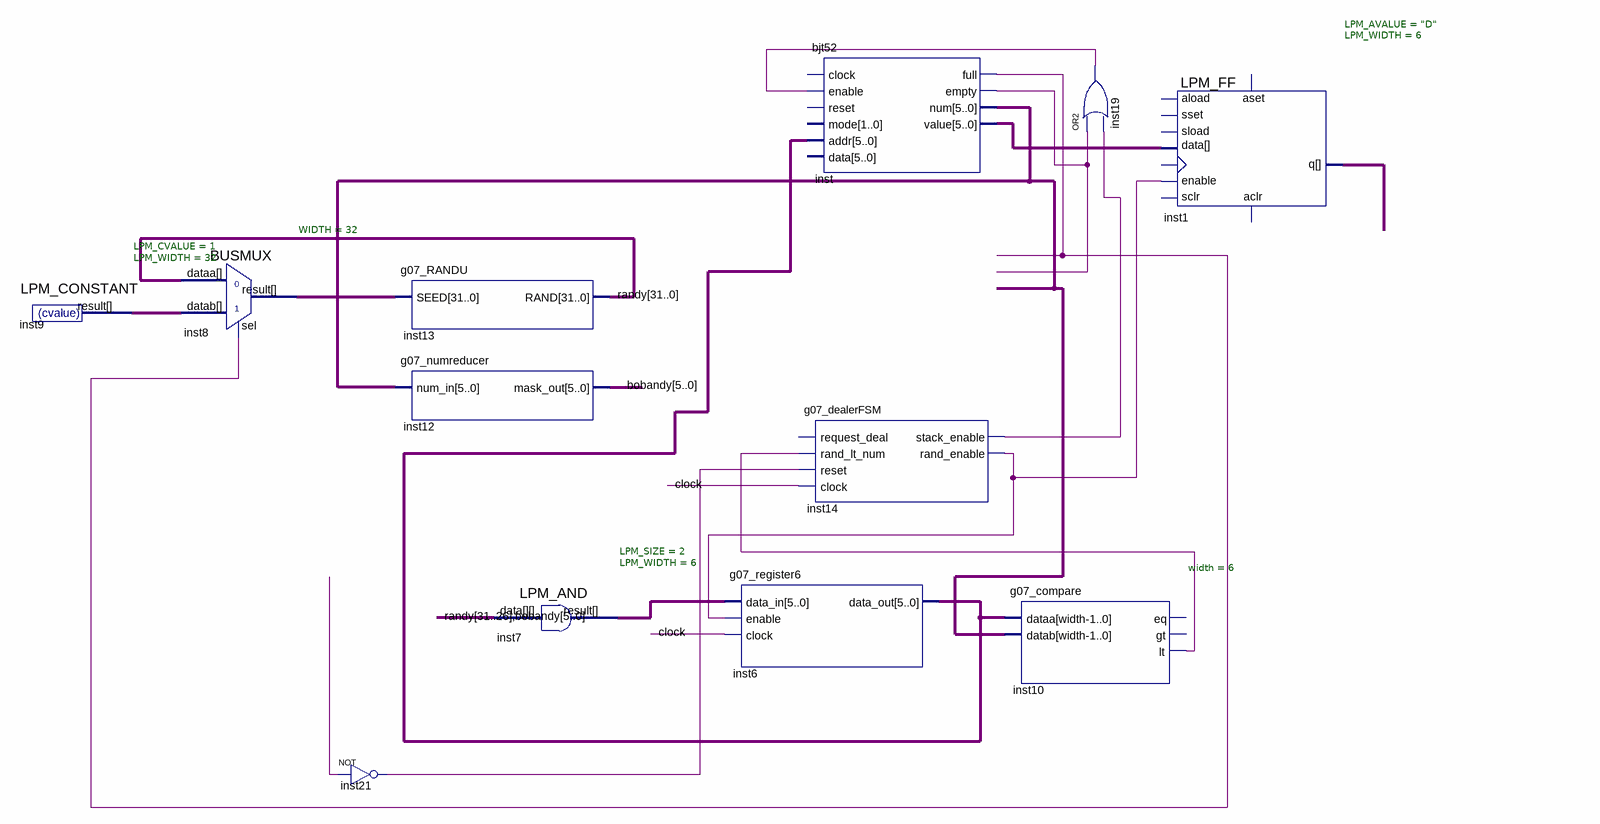
[diagram p0: schematic sheet]
// Quartus schematic g07_dealer_testbed.bdf as structural Verilog: 12 symbols, 0 pins
module g07_dealer_testbed (
);

  wire clock, inst10_lt, inst14_rand_enable, inst14_stack_enable, inst19_out, inst21_out, inst_empty,
       inst_full, undriven;
  wire [5:0] bobandy, inst1_q, inst6_data_out, inst7_result, inst_num, inst_value;
  wire [31:0] inst8_result, inst9_result, randy;

  LPM_CONSTANT #(.LPM_CVALUE(1), .LPM_WIDTH(32)) inst9 (.result(inst9_result));
  BUSMUX #(.WIDTH(32)) inst8 (.datab(inst9_result), .sel(inst_full), .dataa(randy), .result(inst8_result));
  not inst21 (inst21_out, undriven);
  g07_RANDU inst13 (.SEED(inst8_result), .RAND(randy));
  g07_numreducer inst12 (.num_in(inst_num), .mask_out(bobandy));
  LPM_AND #(.LPM_SIZE(2), .LPM_WIDTH(6)) inst7 (.data({randy[31:26], bobandy}), .result(inst7_result));
  g07_register6 inst6 (.data_in(inst7_result), .enable(inst14_rand_enable), .clock(clock), .data_out(inst6_data_out));
  bjt52 inst (
    .enable(inst19_out), .addr(inst6_data_out), .full(inst_full), .empty(inst_empty), .num(inst_num),
    .value(inst_value));  // open: clock, reset, mode, data
  g07_dealerFSM inst14 (
    .rand_lt_num(inst10_lt), .reset(inst21_out), .clock(clock), .stack_enable(inst14_stack_enable),
    .rand_enable(inst14_rand_enable));  // open: request_deal
  g07_compare #(.width(6)) inst10 (.dataa(inst6_data_out), .datab(inst_num), .lt(inst10_lt));  // open: eq, gt
  or inst19 (inst19_out, inst_empty, inst14_stack_enable);
  LPM_FF #(.LPM_AVALUE("D"), .LPM_WIDTH(6)) inst1 (
    .enable(inst14_rand_enable), .data(inst_value), .q(inst1_q));  // open: clock, aload, sset, sload, aset, sclr, aclr
endmodule
